# Altium schematic sheet reefpi_pico_io.SchDoc: reef-pi Pico IO Buffers
size A4; DocumentNumber: 5; Revision: C; SheetNumber: 5; SheetTotal: 8
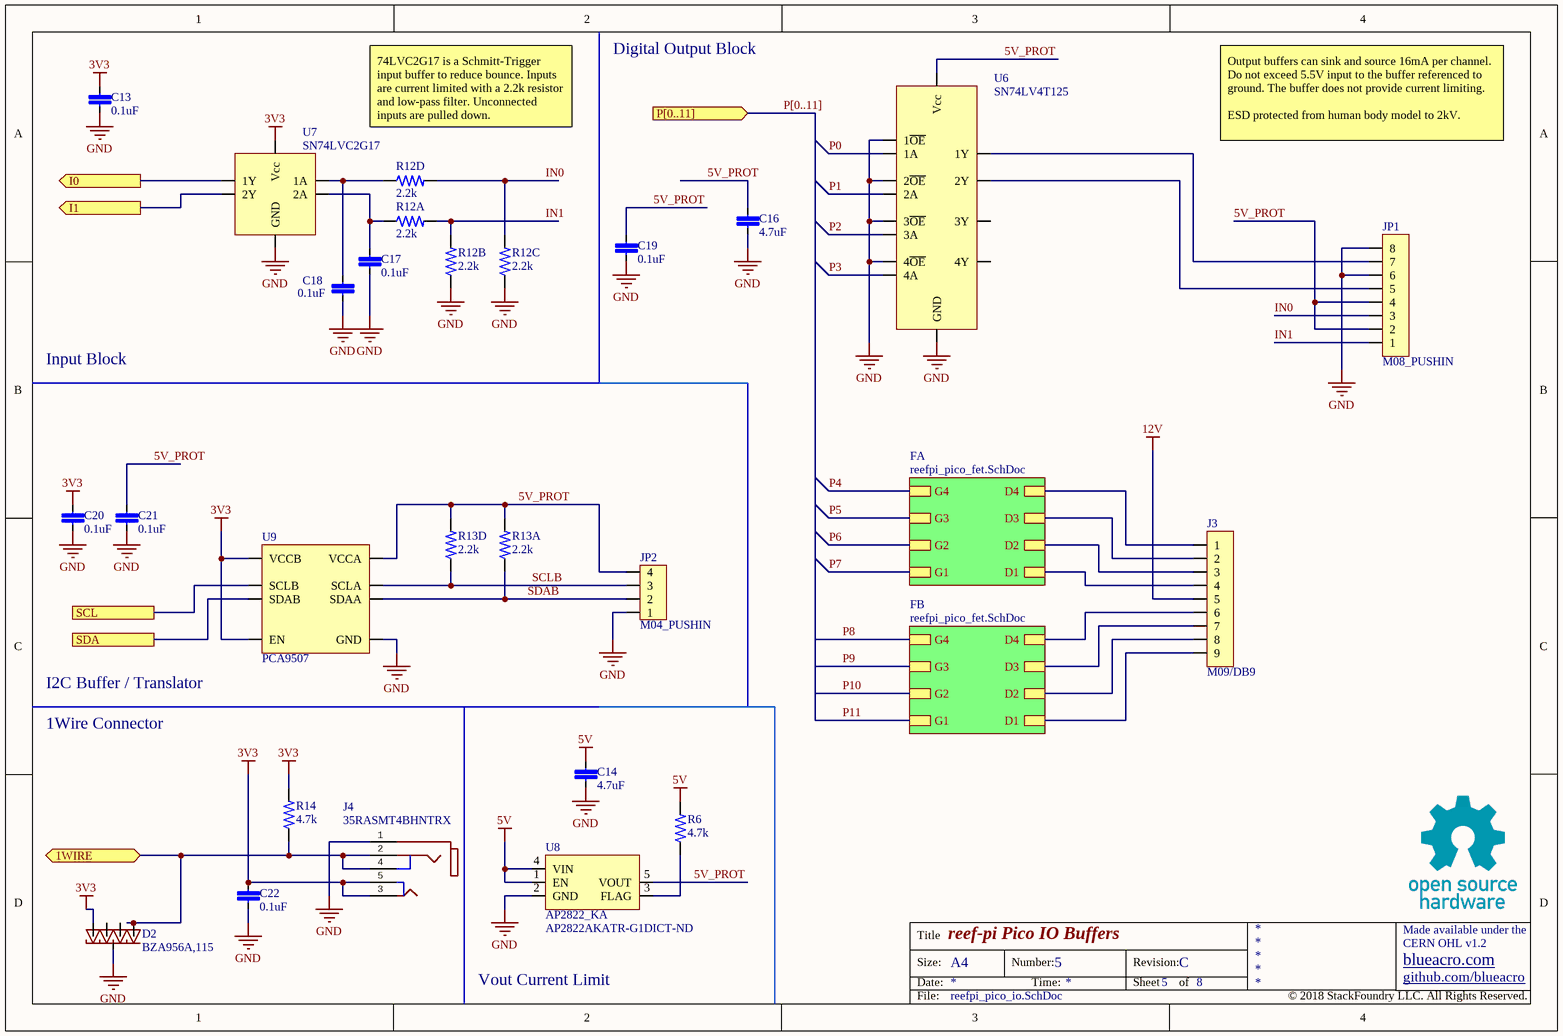
[diagram p0: reefpi_pico_io.SchDoc]

## Parts
C13  0.1uF  [C0603]
C14  4.7uF  [C1210]
C16  4.7uF  [C1210]
C17  0.1uF  [C0603]
C18  0.1uF  [C0603]
C19  0.1uF  [C0603]
C20  0.1uF  [C0603]
C21  0.1uF  [C0603]
C22  0.1uF  [C0603]
D2  BZA956A,115  [SOT665]
J3  M09/DB9  [D09S33E4GV00LF]
J4  35RASMT4BHNTRX  [35RASMT4BHNTRX]
JP1  M08_PUSHIN  [PHOENIX_PTSM_8_1778829]
JP2  M04_PUSHIN  [PHOENIX_PTSM_4_1814935]
R6  4.7k  [R0603]
R12  2.2k  [R0603x4]  (parts A,B,C,D of 4)
R13  2.2k  [R0603x4]  (parts A,D of 4)
R14  4.7k  [R0603]
U6  SN74LV4T125  [PW14]
U7  SN74LVC2G17  [SOT23-6]
U8  AP2822_KA  Supplier Part Number 1: AP2822AKATR-G1DICT-ND  [SOT23-5L]
U9  PCA9507  [SO-8]

## Sub-sheets
FA = reefpi_pico_fet.SchDoc: G3, D2, G4, D1, G1, G2, D3, D4
FB = reefpi_pico_fet.SchDoc: G3, D2, G4, D1, G1, G2, D3, D4

## Ports
1WIRE (bidir), I0 (out), I1 (out), P[0..11] (in), SCL, SDA

## Nets
3V3: C13.1 C20.1 C22.1 D2.5 J4.3(TIP) J4.5(MID) R14.2 U7.5(Vcc) U9.5(EN) U9.8(VCCB)
5V: C14.1 R6.2 U8.1(EN) U8.4(VIN)
12V: J3.5
GND: C13.2 C14.2 C16.2 C17.2 C18.2 C19.2 C20.2 C21.2 C22.2 D2.2 J4.1(OUTER) JP1.6 JP1.8 JP2.1 R12.3 R12.5 U6.1(1~{OE}) U6.4(2~{OE}) U6.7(GND) U6.10(3~{OE}) U6.13(4~{OE}) U7.2(GND) U8.2(GND) U9.4(GND)
1WIRE: D2.1 J4.2(MID) J4.4(MID) R14.1 ; port 1WIRE
5V_PROT: C16.1 C19.1 C21.1 JP1.2 JP1.4 JP2.4 R13.2 R13.8 U6.14(Vcc) U8.5(VOUT) U9.1(VCCA)
I0: U7.6(1Y) ; port I0
I1: U7.4(2Y) ; port I1
IN0: JP1.3 R12.6 R12.8
IN1: JP1.1 R12.2 R12.4
P0: U6.2(1A)
P1: U6.5(2A)
P2: U6.9(3A)
P3: U6.12(4A)
P4: sheet FA/G4
P5: sheet FA/G3
P6: sheet FA/G2
P7: sheet FA/G1
P8: sheet FB/G4
P9: sheet FB/G3
P10: sheet FB/G2
P11: sheet FB/G1
SCL: U9.7(SCLB) ; port SCL
SCLB: JP2.3 R13.7 U9.2(SCLA)
SDA: U9.6(SDAB) ; port SDA
SDAB: JP2.2 R13.1 U9.3(SDAA)
NetC17_1: C17.1 R12.1 U7.3(2A)
NetC18_1: C18.1 R12.7 U7.1(1A)
NetJ3_1: J3.1 ; sheet FA/D4
NetJ3_2: J3.2 ; sheet FA/D3
NetJ3_3: J3.3 ; sheet FA/D2
NetJ3_4: J3.4 ; sheet FA/D1
NetJ3_6: J3.6 ; sheet FB/D4
NetJ3_7: J3.7 ; sheet FB/D3
NetJ3_8: J3.8 ; sheet FB/D2
NetJ3_9: J3.9 ; sheet FB/D1
NetJP1_5: JP1.5 U6.6(2Y)
NetJP1_7: JP1.7 U6.3(1Y)
NetR6_1: R6.1 U8.3(FLAG)

Not connected (* = marked no-connect by the designer): D2 3 4; U6 8(3Y) 11(4Y)

## Buses and harness runs
bus P[0..11] = port P[0..11]

## Notes on the sheet
- Digital Output Block
- 74LVC2G17 is a Schmitt-Trigger input buffer to reduce bounce. Inputs are current limited with a 2.2k resistor and low-pass filter. Unconnected inputs are pulled down.
- Output buffers can sink and source 16mA per channel. Do not exceed 5.5V input to the buffer referenced to ground. The buffer does not provide current limiting.
  ESD protected from human body model to 2kV.
- Input Block
- (near U9) I2C Buffer / Translator
- 1Wire Connector
- Vout Current Limit
- Title
- Size:
- Date:
- A4
- Number:
- Time:
- Revision:
- Sheet
- of
- github.com/blueacro
- blueacro.com
- CERN OHL v1.2
- Made available under the
- File:
- © 2018 StackFoundry LLC. All Rights Reserved.

## Library data of the parts
C13 C14 C16-C22 = C-EU
D2 = DIODE_TVS_4x
R6 R14 = R-US
R12 R13 = R-US-4ch
U8 = AP2822_KA: Supplier 1: Digi-Key